# EAGLE design 4180_Board_rev1 (EAGLE 9.6.2)
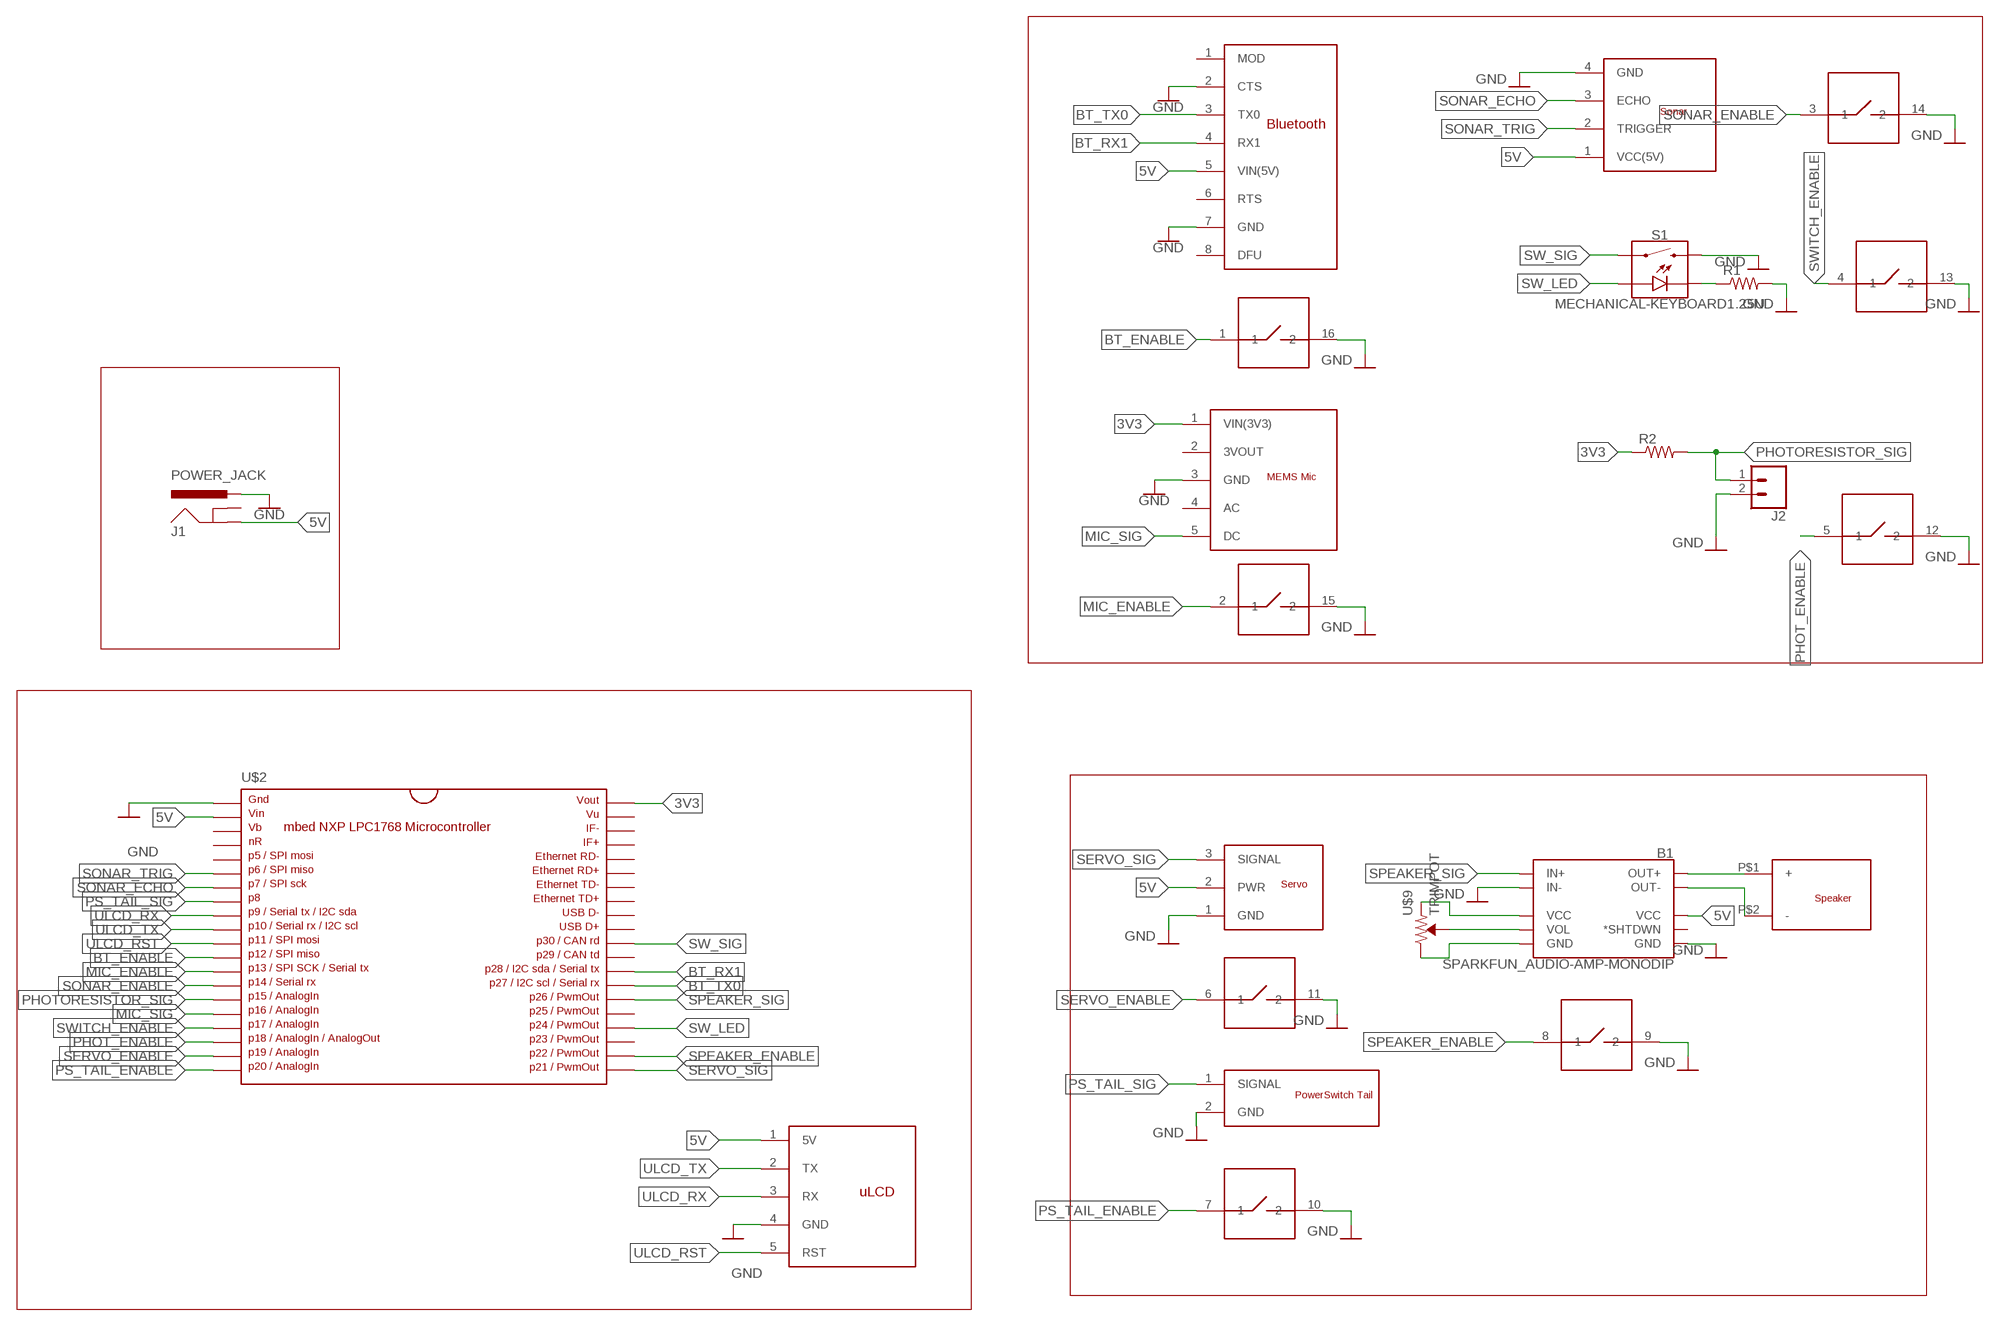
[diagram p0: schematic, sheet 1]

## Parts
B1  SPARKFUN_AUDIO-AMP-MONODIP  [AUDIO-AMP-MONO]
J1  POWER_JACK  [POWER_JACK_PTH]
J2  CONN_02  [1X02]
R1  ADAFRUIT_R-US_0309/12  [ADAFRUIT_0309/12]
R2  ADAFRUIT_R-US_0309/12  [ADAFRUIT_0309/12]
S1  MECHANICAL-KEYBOARD1.25U  [CHERRY-MX-LED-1.25U]
U$1  BLUETOOTH  [1X08]
U$2  MBED1768  MBED_NXP_LPC1768  [DIL40_0.9]
U$3  MEMS_MIC  [1X05]
U$4  POWERSWITCHTAIL  [1X02]
U$5  SERVO  [1X03]
U$6  SONAR  [1X04]
U$7  SPEAKER  [SPEAKER]
U$8  ULCD  [1X05]
U$9  TRIMPOT  [TRIMPOT]
U$10  DIP_SWITCH_8  [DIP16]

## Nets
3V3: R2.1 U$2.40 U$3.1(VIN(3V3))
5V: B1.PWR+(VCC) J1.PWR(GND) U$1.5(VIN(5V)) U$2.2 U$5.2(PWR) U$6.1(VCC(5V)) U$8.1(5V)
BT_ENABLE: U$2.12 U$10.1
BT_RX1: U$1.4(RX1) U$2.28
BT_TX0: U$1.3(TX0) U$2.27
GND: B1.IN- B1.PWR-(GND) J1.GND(PWR) J2.2 R1.2 S1.S2 U$1.2(CTS) U$1.7(GND) U$2.1 U$3.3(GND) U$4.2(GND) U$5.1(GND) U$6.4(GND) U$8.4(GND) U$10.9 U$10.10 U$10.11 U$10.12 U$10.13 U$10.14 U$10.15 U$10.16
MIC_ENABLE: U$2.13 U$10.2
MIC_SIG: U$2.16 U$3.5(DC)
N$3: R1.1 S1.K(C)
N$4: B1.VOL+(VCC) U$9.P$1(CCW)
N$5: B1.VOL U$9.P$3(WIPER)
N$6: B1.VOL-(GND) U$9.P$2(CW)
N$9: B1.OUT+ U$7.P$1(+)
N$10: B1.OUT- U$7.P$2(-)
PHOT_ENABLE: U$2.18 U$10.5
PHOTORESISTOR_SIG: J2.1 R2.2 U$2.15
PS_TAIL_ENABLE: U$2.20 U$10.7
PS_TAIL_SIG: U$2.8 U$4.1(SIGNAL)
SERVO_ENABLE: U$2.19 U$10.6
SERVO_SIG: U$2.21 U$5.3(SIGNAL)
SONAR_ECHO: U$2.7 U$6.3(ECHO)
SONAR_ENABLE: U$2.14 U$10.3
SONAR_TRIG: U$2.6 U$6.2(TRIGGER)
SPEAKER_ENABLE: U$2.22 U$10.8
SPEAKER_SIG: B1.IN+ U$2.26
SW_LED: S1.A U$2.24
SW_SIG: S1.S1 U$2.30
SWITCH_ENABLE: U$2.17 U$10.4
ULCD_RST: U$2.11 U$8.5(RST)
ULCD_RX: U$2.9 U$8.3(RX)
ULCD_TX: U$2.10 U$8.2(TX)
Unconnected: B1.S(*SHTDWN) J1.GNDBREAK U$1.1(MOD) U$1.6(RTS) U$1.8(DFU) U$2.3 U$2.4 U$2.5 U$2.23 U$2.25 U$2.29 U$2.31 U$2.32 U$2.33 U$2.34 U$2.35 U$2.36 U$2.37 U$2.38 U$2.39 U$3.2(3VOUT) U$3.4(AC)

## Notes on the sheet
- Bluetooth

## Library data of the parts
B1 = 4180Library:SPARKFUN_AUDIO-AMP-MONO: SparkFun Mono Audio Amp Breakout- TPA2005D1 This tiny audio amplifier is based on the Texas Instruments TPA2005D1. Its efficient class-D operation means low heat and long battery life. It can drive an 8-Ohm speaker at up to 1.4 Watts SparkFun Products: Mono Audio Amp Breakout <https://www.sparkfun.com/products/11044>
J1 = 4180Library:POWER_JACK: Power Jack Connector This is the standard 5.5mm barrel jack for power. The PTH is the most common, proven, reliable, footprint. The Slot footprint only works if the mill layer is transmitted to the PCB fab house so be warned. Here are the connectors we sell at SparkFun: DC Barrel Power Jack/Connector <https://www.sparkfun.com/products/119> (PRT-00119) DC Barrel Power Jack/Connector (SMD) <https://www.sparkfun.com/products/12748> (PRT-12748) DC Barrel Jack Adapter - Breadboard Compatible <https://www.sparkfun.com/products/10811> (PRT-10811) It is used on this SparkFun product (and many, many others): SparkFun RedBoard - Programmed with Arduino <https://www.sparkfun.com/products/12757> (DEV-12757) Also, if you need a mating power supply or connector, please check these out: Wall Adapter Power Supply - 9VDC 650mA <https://www.sparkfun.com/products/298> (TOL-00298) DC Barrel Jack Adapter - Male <https://www.sparkfun.com/products/10287> (PRT-10287); PROD_ID: CONN-08197
J2 = SparkFun-Connectors:CONN_02: Multi connection point. Often used as Generic Header-pin footprint for 0.1 inch spaced/style header connections On any of the 0.1 inch spaced packages, you can populate with these: Break Away Headers - Straight <https://www.sparkfun.com/products/116> (PRT-00116) Break Away Male Headers - Right Angle <https://www.sparkfun.com/products/553> (PRT-00553) Female Headers <https://www.sparkfun.com/products/115> (PRT-00115) Break Away Headers - Machine Pin <https://www.sparkfun.com/products/117> (PRT-00117) Break Away Female Headers - Swiss Machine Pin <https://www.sparkfun.com/products/743> (PRT-00743) For SCREWTERMINALS and SPRING TERMINALS visit here: Screw Terimnals on SparkFun.com <https://www.sparkfun.com/search/results?term=Screw+Terminals> (5mm/3.5mm/2.54mm spacing) This device is also useful as a general connection point to wire up your design to another part of your project. Our various solder wires solder well into these plated through hole pads. Hook-Up Wire - Assortment (Stranded, 22 AWG) <https://www.sparkfun.com/products/11375> (PRT-11375) Hook-Up Wire - Assortment (Solid Core, 22 AWG) <https://www.sparkfun.com/products/11367> (PRT-11367) View the entire wire category on our website here <https://www.sparkfun.com/categories/141> Special notes: Molex polarized connector foot print use with: PRT-08233 with associated crimp pins and housings. 2.54_SCREWTERM for use with PRT-10571. 3.5mm Screw Terminal footprints for PRT-08084 5mm Screw Terminal footprints for use with PRT-08432
R1 R2 = FinalProject:ADAFRUIT_R-US_: RESISTOR, American symbol
S1 = 4180Library:MECHANICAL-KEYBOARD: Mechanical Keyboard Spacings for Cherry-MX Cherry-MX w/ LED switch footprints. Each package variant contains a bounding box on the tDocu layer for proper key spacing and a dimensional drawing on the Reference layer to be exported for laser cut mounting plates. Footprints are off-center so that the origin lies on the lower left corner of the key-spacing. This allows for most common layouts to be easily acheived on a grid spacing of 0.1875" Variants 1U through 1.75U in .25U steps Centered switch cutout in SwitchPlate layer with no stabilizers 2U through 2.75U in .25U steps Centered switch cutout in SwitchPlate layer with Cherry+Costar stabilizer holes 6.25U Common spacebar size Centered switch cutout in SwitchPlate layer with Cherry+Costar stabilizer holes "Big Ass" Enter ANSI 104 "Big Ass" Enter Key layout ISO Enter ISO style Enter Key layout
U$1 = 4180Library:BLUETOOTH
U$2 = 4180Library:MBED_NXP_LPC1768: mbed LPC1768 board footprint Boards using this footprint: mbed - LPC1768 (Cortex-M3) (DEV-09564); PROD_ID: COMP-12167
U$3 = 4180Library:MEMS_MIC
U$4 = 4180Library:POWERSWITCHTAIL
U$5 = 4180Library:SERVO
U$6 = 4180Library:SONAR
U$7 = 4180Library:SPEAKER
U$8 = 4180Library:ULCD
U$9 = digitalEffectPedalLibrary:TRIMPOT
U$10 = 4180Library:DIP_SWITCH_8

## Board
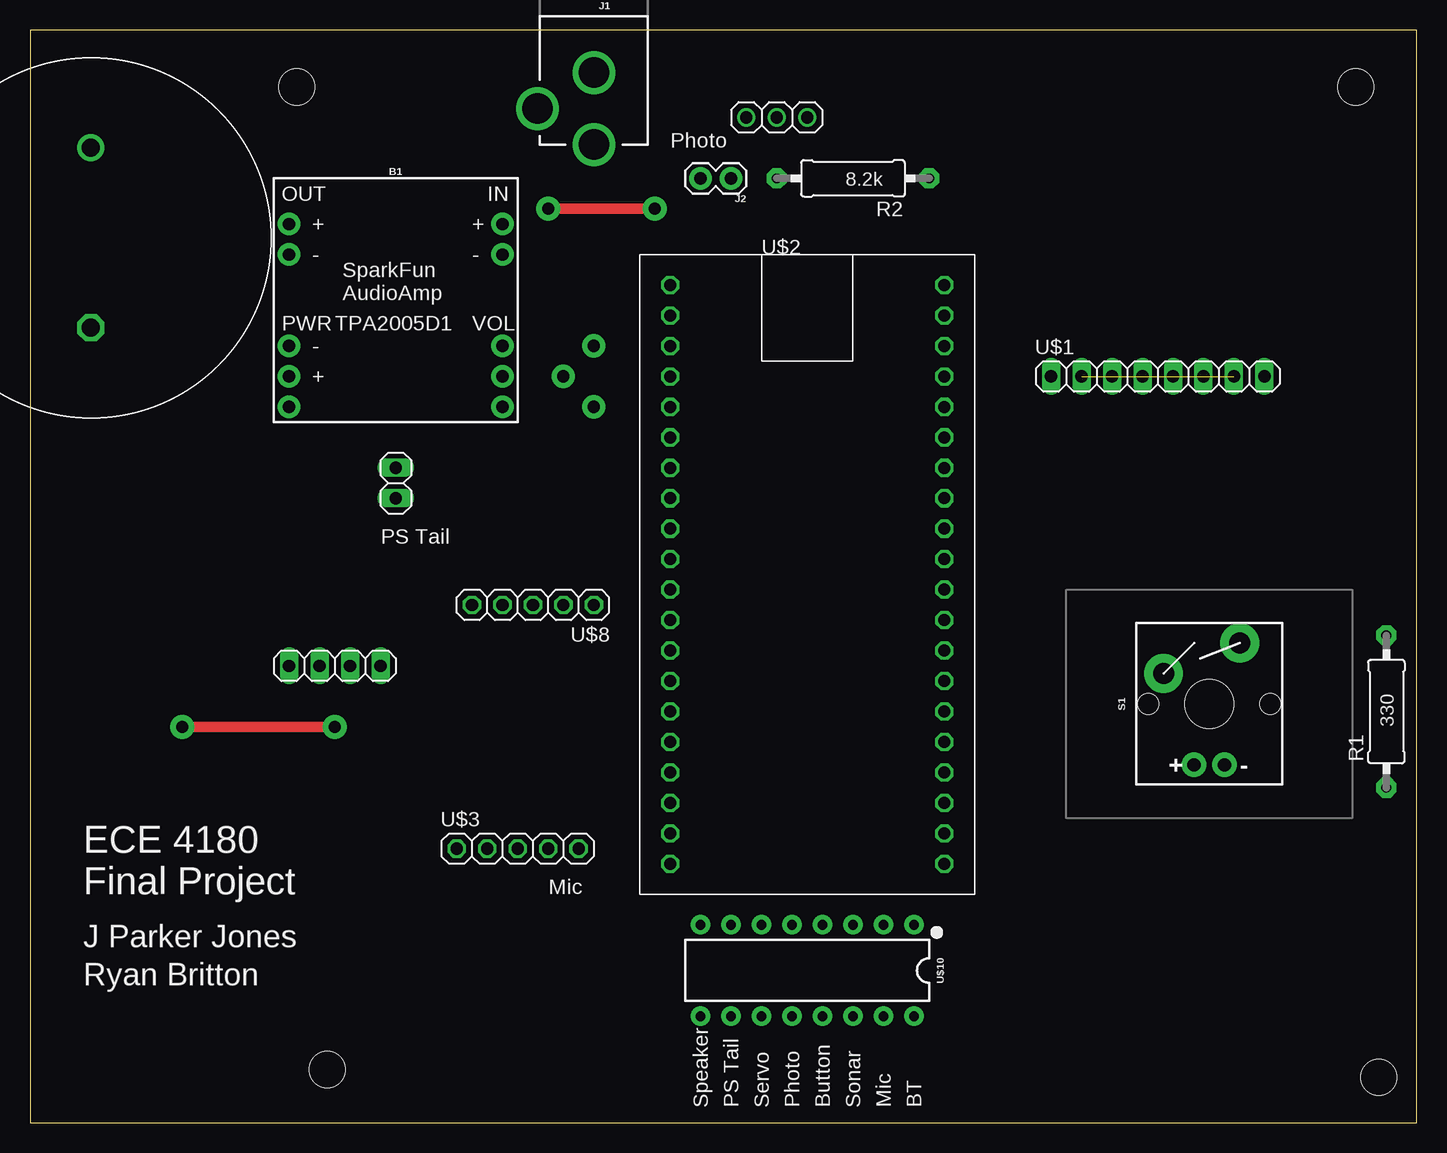
[diagram p1: board, top side]
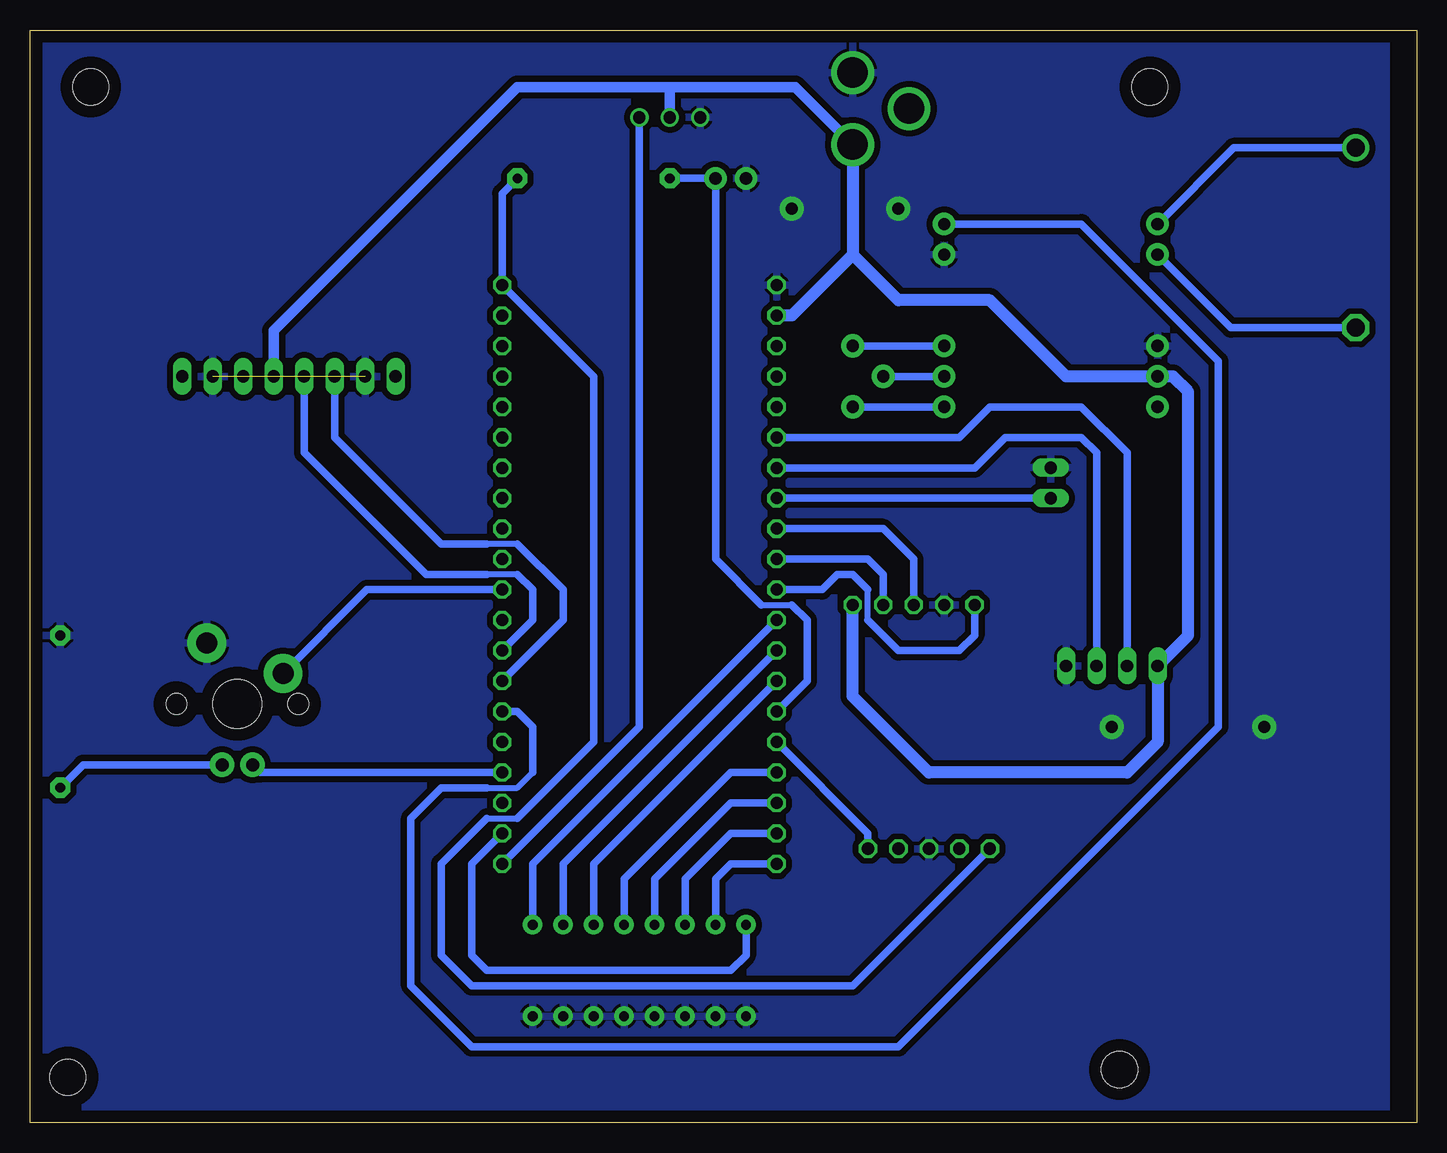
[diagram p2: board, bottom side, seen from below]

Size 115.55 x 91.11 mm. Coordinates in mm from the lower left corner, seen from the top.
Outline: 0,0 115.55,0 115.55,91.11 0,91.11 0,0
Copper layers (1*16): Top 0.035mm / dielectric 1.5mm / Bottom 0.035mm
Design rules "default *": minimum track width 6mil, minimum drill 0.35mm, track to track 20mil, track to pad 20mil, pad to pad 20mil, via to via 20mil, smd to smd 20mil, copper to edge 40mil, drill to drill 6mil, minimum pad ring 10mil, minimum via ring 8mil, stop-mask expansion 4mil, vias tented up to drill 0mil, thermal gap 10mil
Holes 3 mm at 22.23,86.36 110.49,86.36 112.39,3.81 24.77,4.45

### Footprints (pad centres in the part's own frame; a part is rotated, then mirrored left to right if it is on the bottom)
AUDIO-AMP-MONO = drill 1.016 pad 1.88: IN+ 8.89,6.35; IN- 8.89,3.81; OUT+ -8.89,6.35; OUT- -8.89,3.81; PWR+ -8.89,-6.35; PWR- -8.89,-3.81; S -8.89,-8.89; VOL 8.89,-6.35; VOL+ 8.89,-8.89; VOL- 8.89,-3.81
POWER_JACK_PTH = drill 2.54: GND 0,7.7; GNDBREAK 4.7,10.7; PWR 0,13.7
1X02 = drill 1.016 pad 1.88: 1 0,0; 2 2.54,0
ADAFRUIT_0309/12 = drill 0.813 pad 1.676 octagon: 1 -6.35,0; 2 6.35,0
CHERRY-MX-LED-1.25U = drill 1.092 pad 2.032: A 10.643,4.445; K 13.183,4.445 | drill 1.753 pad 3.226: S1 8.103,12.065; S2 14.453,14.605 | hole 4.089: 11.913,9.525 | hole 1.707: 6.833,9.525; 16.993,9.525
1X08 = drill 1.016 long: 1 -8.89,0; 2 -6.35,0; 3 -3.81,0; 4 -1.27,0; 5 1.27,0; 6 3.81,0; 7 6.35,0; 8 8.89,0
DIL40_0.9 = drill 1 pad 1.397 octagon: 1 -22.86,-11.43; 2 -20.32,-11.43; 3 -17.78,-11.43; 4 -15.24,-11.43; 5 -12.7,-11.43; 6 -10.16,-11.43; 7 -7.62,-11.43; 8 -5.08,-11.43; 9 -2.54,-11.43; 10 0,-11.43; 11 2.54,-11.43; 12 5.08,-11.43; 13 7.62,-11.43; 14 10.16,-11.43; 15 12.7,-11.43; 16 15.24,-11.43; 17 17.78,-11.43; 18 20.32,-11.43; 19 22.86,-11.43; 20 25.4,-11.43; 21 25.4,11.43; 22 22.86,11.43; 23 20.32,11.43; 24 17.78,11.43; 25 15.24,11.43; 26 12.7,11.43; 27 10.16,11.43; 28 7.62,11.43; 29 5.08,11.43; 30 2.54,11.43; 31 0,11.43; 32 -2.54,11.43; 33 -5.08,11.43; 34 -7.62,11.43; 35 -10.16,11.43; 36 -12.7,11.43; 37 -15.24,11.43; 38 -17.78,11.43; 39 -20.32,11.43; 40 -22.86,11.43
1X05 = drill 1.016 octagon: 1 -6.35,0; 2 -3.81,0; 3 -1.27,0; 4 1.27,0; 5 3.81,0
1X02' = drill 1.016 long: 1 -1.27,0; 2 1.27,0
1X03 = drill 1.016: 1 -2.54,0; 2 0,0; 3 2.54,0
1X04 = drill 1.016 long: 1 -3.81,0; 2 -1.27,0; 3 1.27,0; 4 3.81,0
SPEAKER = drill 1.5: P$1 0,0 | drill 1.5 octagon: P$2 15,0
TRIMPOT = drill 1.016 pad 1.93: P$1 0,0; P$2 5.08,0; P$3 2.54,2.54
DIP16 = drill 0.813 pad 1.626: 1 -8.89,-3.81; 2 -6.35,-3.81; 3 -3.81,-3.81; 4 -1.27,-3.81; 5 1.27,-3.81; 6 3.81,-3.81; 7 6.35,-3.81; 8 8.89,-3.81; 9 8.89,3.81; 10 6.35,3.81; 11 3.81,3.81; 12 1.27,3.81; 13 -1.27,3.81; 14 -3.81,3.81; 15 -6.35,3.81; 16 -8.89,3.81

### Placement (x,y rotation side)
B1  30.48,68.58 0 top
J1  46.99,95.25 180 top
J2  58.42,78.74 180 top
R1  113.03,34.29 90 top
R2  68.58,78.74 180 top
S1  86.36,25.4 0 top
U$1  93.98,62.23 0 top
U$2  64.77,46.99 270 top
U$3  41.91,22.86 0 top
U$4  POWERSWITCHTAIL  [1X02']  30.48,53.34 90 top
U$5  62.23,83.82 0 top
U$6  25.4,38.1 0 top
U$7  5.08,81.28 270 top
U$8  40.64,43.18 180 top
U$9  46.99,59.69 90 top
U$10  64.77,12.7 180 top

### Tracks (layer width: path | path; a pad name or v marks a point on that pad's centre or on a via)
3V3
  Bottom 0.508: 77.47,25.4 74.93,25.4
  Bottom 0.635: U$3.1 46.99,11.43 78.74,11.43 81.28,13.97 81.28,21.59 77.47,25.4 | 74.93,25.4 68.58,31.75 68.58,62.23 U$2.40 76.2,77.47 R2.1
5V
  Bottom 0.889: U$1.5 95.25,66.04 74.93,86.36 62.23,86.36 | J1.PWR 51.8,86.36 62.23,86.36 | U$5.2 62.23,86.36
  Bottom 1.016: J1.PWR 46.99,72.39 | 46.99,72.39 52.07,67.31 U$2.2 | 46.99,72.39 43.18,68.58 35.56,68.58 29.21,62.23 B1.PWR+ 20.32,62.23 19.05,60.96 19.05,40.64 U$6.1 21.59,31.75 24.13,29.21 40.64,29.21 46.99,35.56 U$8.1
BT_ENABLE
  Bottom 0.635: U$2.12 73.66,21.59 U$10.1
BT_RX1
  Bottom 0.508: 74.93,45.72 77.47,45.72
  Bottom 0.635: U$2.28 73.66,41.91 73.66,44.45 74.93,45.72 | 77.47,45.72 82.55,45.72 92.71,55.88 U$1.4
BT_TX0
  Bottom 0.508: 74.93,48.26 77.47,48.26
  Bottom 0.635: U$2.27 71.12,41.91 71.12,44.45 74.93,48.26 | 77.47,48.26 81.28,48.26 90.17,57.15 U$1.3
GND  (via drill 1 pad 2)  (1 unrouted)
  Top 0.889: v12.7,33.02 v25.4,33.02 | v43.18,76.2 v52.07,76.2
  pour Bottom: 2.54,0.64 114.3,0.64 114.3,90.81 2.54,90.81
MIC_ENABLE
  Bottom 0.635: U$10.2 71.12,21.59 U$2.13
MIC_SIG
  Bottom 0.635: U$3.5 45.72,24.13 U$2.16
N$3
  Bottom 0.635: S1.K 111.12,29.84 R1.1
N$4
  Bottom 0.635: U$9.P$1 B1.VOL+
N$5
  Bottom 0.635: U$9.P$3 B1.VOL
N$6
  Bottom 0.635: U$9.P$2 B1.VOL-
N$9
  Bottom 0.635: U$7.P$1 15.24,81.28 B1.OUT+
N$10
  Bottom 0.635: U$7.P$2 15.48,66.28 B1.OUT-
PHOT_ENABLE
  Bottom 0.635: U$10.5 63.5,20.32 57.15,26.67 U$2.18
PHOTORESISTOR_SIG
  Bottom 0.508: 54.61,43.18 52.07,43.18
  Bottom 0.635: U$2.15 50.8,36.83 50.8,41.91 52.07,43.18 | R2.2 J2.1 58.42,46.99 54.61,43.18
PS_TAIL_ENABLE
  Bottom 0.635: U$10.7 58.42,20.32 57.15,21.59 U$2.20
PS_TAIL_SIG
  Bottom 0.635: U$4.1 U$2.8
SERVO_ENABLE
  Bottom 0.635: U$10.6 60.96,20.32 57.15,24.13 U$2.19
SERVO_SIG
  Bottom 0.635: U$5.3 64.77,33.02 U$2.21
SONAR_ECHO
  Bottom 0.635: U$6.3 26.67,55.88 27.94,57.15 34.29,57.15 36.83,54.61 U$2.7
SONAR_ENABLE
  Bottom 0.635: U$10.3 68.58,21.59 U$2.14
SONAR_TRIG
  Bottom 0.635: U$6.2 24.13,55.88 27.94,59.69 35.56,59.69 38.1,57.15 U$2.6
SPEAKER_ENABLE
  Bottom 0.635: U$10.8 55.88,13.97 57.15,12.7 77.47,12.7 78.74,13.97 78.74,21.59 U$2.22
SPEAKER_SIG
  Bottom 0.508: 77.47,27.94 74.93,27.94 73.66,29.21
  Bottom 0.635: B1.IN+ 27.94,74.93 16.51,63.5 16.51,33.02 43.18,6.35 78.74,6.35 83.82,11.43 83.82,25.4 81.28,27.94 77.47,27.94 | 73.66,29.21 73.66,33.02 74.93,34.29 U$2.26
SW_LED
  Bottom 0.635: U$2.24 96.37,29.21 S1.A
SW_SIG
  Bottom 0.635: S1.S1 87.48,44.45 U$2.30
SWITCH_ENABLE
  Bottom 0.635: U$10.4 66.04,20.32 57.15,29.21 U$2.17
ULCD_RST
  Bottom 0.508: 45.72,41.91 45.72,44.45
  Bottom 0.635: U$8.5 36.83,40.64 38.1,39.37 43.18,39.37 45.72,41.91 | U$2.11 49.53,44.45 48.26,45.72 46.99,45.72 45.72,44.45
ULCD_RX
  Bottom 0.635: U$8.3 41.91,46.99 44.45,49.53 U$2.9
ULCD_TX
  Bottom 0.635: U$8.2 44.45,45.72 45.72,46.99 U$2.10

### Text on the board
tNames: Photo | 8.2k | PS Tail | 330 | ECE 4180 / Final Project | Mic | J Parker Jones | Ryan Britton | Speaker | PS Tail | Servo | Photo | Button | Sonar | Mic | BT